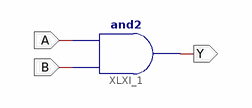
[diagram p0: schematic sheet 1]
// Xilinx ISE schematic schemat1.sch (artix7) as structural Verilog: 1 symbols, 3 ports
module schemat1 (
  input  A,
  input  B,
  output Y
);

  and XLXI_1 (Y, B, A);
endmodule
